# Altium schematic sheet Baro.SchDoc
size A4; SheetNumber: 8; SheetTotal: 11
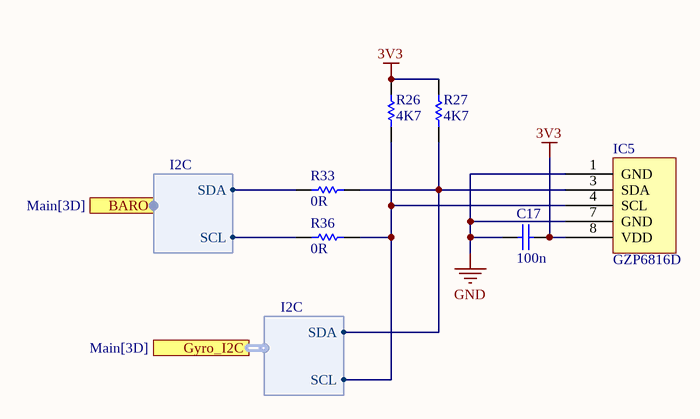
[diagram p0: Baro.SchDoc]

## Parts
C17  100n  [CAPC0603(1608)55_N]
IC5  GZP6816D  [GZP6816D]
R26  4K7  [RESC0603(1608)_N]
R27  4K7  [RESC0603(1608)_N]
R33  0R  [RESC1005X40X25NL05T10]
R36  0R  [RESC1005X40X25NL05T10]

## Ports
BARO (harness I2C, see Main[3D]), Gyro_I2C (harness I2C, see Main[3D])

## Harnesses
I2C: SDA, SCL

## Nets
3V3: C17.1 IC5.8(VDD) R26.2 R27.2
GND: C17.2 IC5.1(GND) IC5.7(GND)
NetIC5_3: IC5.3(SDA) R27.1 R33.2 ; port Gyro_I2C.SDA
NetIC5_4: IC5.4(SCL) R26.1 R36.2 ; port Gyro_I2C.SCL
NetR33_1: R33.1 ; port BARO.SDA
NetR36_1: R36.1 ; port BARO.SCL

## Library data of the parts
C17 = Cap 100n: Keramikvielschichtkondensator, SMD, Baureihe MC, ± 20%; Manufacturer: Multicomp; OC_FARNELL: 1759038; Value: 100n; PackageReference: 0603
R26 R27 = Res 4k7: Chipwiderstand, SMD, Baureihe MC, 5%; Manufacturer: Multicomp; PackageReference: 0603; Value: 4K7; OC_FARNELL: 9332154
R33 R36 = CMP-1011-00001-2: Manufacturer: Yageo / Phycomp; Part Number: RC0402JR-070RL